# EAGLE schematic controll (EAGLE 5.06)
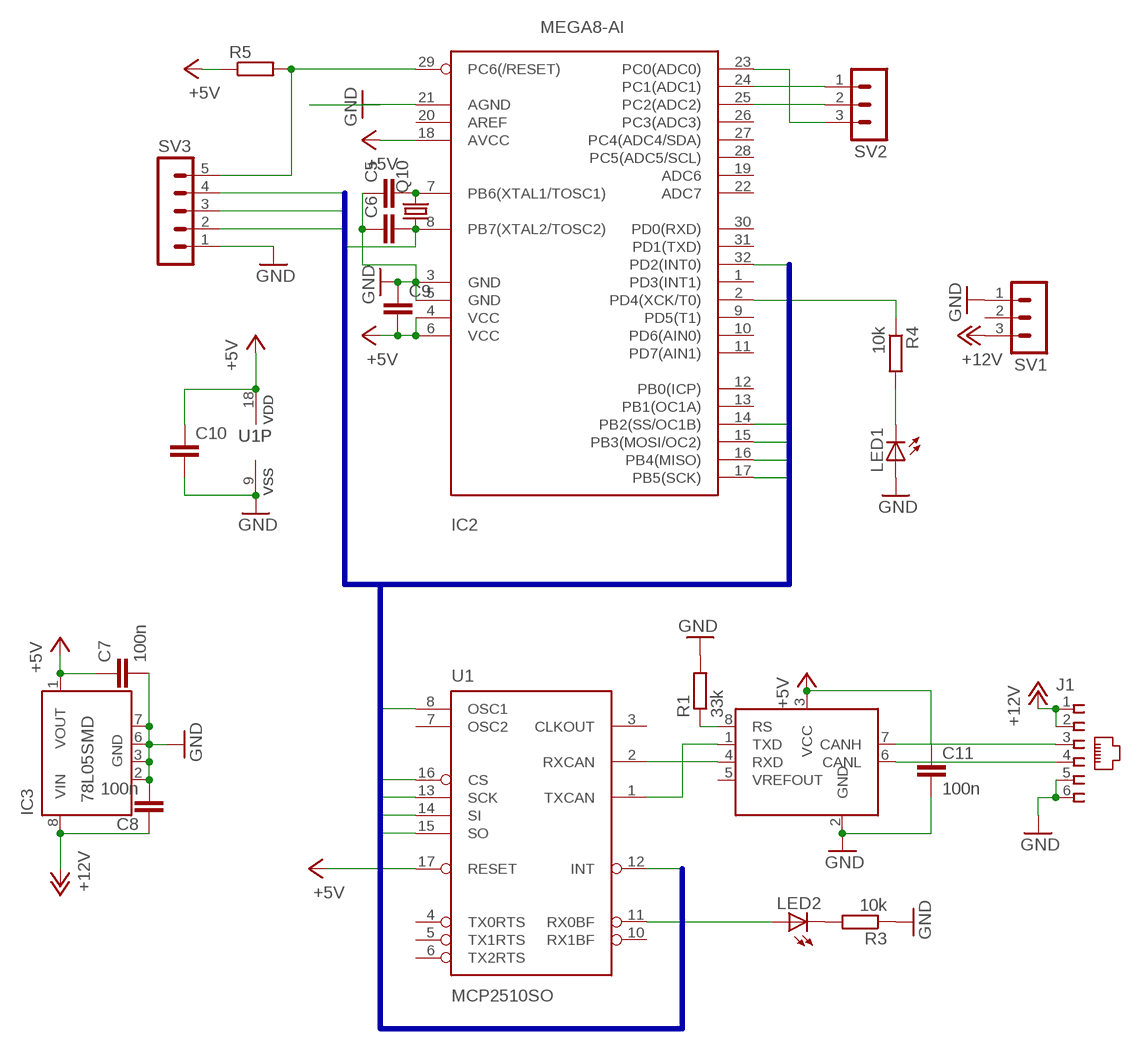
[diagram p0: schematic, sheet 1]

## Parts
C5  C-EUC1206  [C1206]
C6  C-EUC0805  [C0805]
C7  100n  C-EUC0805  [C0805]
C8  100n  C-EUC0805  [C0805]
C9  C-EUC0805  [C0805]
C10  C-EUC0805  [C0805]
C11  100n  C-EUC0805  [C0805]
IC1  82C250SMDSMD  [SO8]
IC2  MEGA8-AI  [TQFP32-08]
IC3  78L05SMD  [SO08]
J1  555165-1  [555165-1]
LED1  LEDCHIPLED_0603  [CHIPLED_0603]
LED2  LEDCHIPLED_0603  [CHIPLED_0603]
Q10  CRYTALHC49S  [HC49/S]
R1  33k  R-EU_R0805  [R0805]
R3  10k  R-EU_R0805  [R0805]
R4  10k  R-EU_R0805  [R0805]
R5  R-EU_R1206  [R1206]
SV1  MA03-1  [MA03-1]
SV2  MA03-1  [MA03-1]
SV3  MA05-1  [MA05-1]
U1  MCP2510SO  [SO-18W]

## Nets
+5V: C7.1 C9.2 C10.1 C11.1 IC1.3(VCC) IC2.4(VCC) IC2.6(VCC) IC2.18(AVCC) IC3.1(VOUT) R5.1 U1.17(RESET) U1.18(VDD)
+12V: C8.1 IC3.8(VIN) J1.1 J1.2 SV1.3
CLK: C6.2 IC2.8(PB7(XTAL2/TOSC2)) Q10.1 U1.8(OSC1)
GND: C5.1 C6.1 C7.2 C8.2 C9.1 C10.2 C11.2 IC1.2(GND) IC2.3(GND) IC2.5(GND) IC2.21(AGND) IC3.2(GND) IC3.3(GND) IC3.6(GND) IC3.7(GND) J1.5 J1.6 LED1.A R1.2 R3.1 SV1.1 SV3.1 U1.9(VSS)
INT: IC2.32(PD2(INT0)) U1.12(INT)
MISO: IC2.16(PB4(MISO)) SV3.2 U1.15(SO)
MOSI: IC2.15(PB3(MOSI/OC2)) SV3.3 U1.14(SI)
N$1: IC2.24(PC1(ADC1)) SV2.1
N$2: IC2.23(PC0(ADC0)) SV2.3
N$3: IC2.25(PC2(ADC2)) SV2.2
N$4: IC2.29(PC6(/RESET)) R5.2 SV3.5
N$15: C5.2 IC2.7(PB6(XTAL1/TOSC1)) Q10.2
N$30: LED1.C R4.2
N$34: IC1.7(CANH) J1.3
N$35: IC1.1(TXD) U1.1(TXCAN)
N$36: IC1.4(RXD) U1.2(RXCAN)
N$37: IC1.8(RS) R1.1
N$38: IC1.6(CANL) J1.4
N$39: LED2.A U1.11(RX0BF)
N$40: LED2.C R3.2
N$41: IC2.2(PD4(XCK/T0)) R4.1
SCK: IC2.17(PB5(SCK)) SV3.4 U1.13(SCK)
SS: IC2.14(PB2(SS/OC1B)) U1.16(CS)
Unconnected: IC1.5(VREFOUT) IC2.1(PD3(INT1)) IC2.9(PD5(T1)) IC2.10(PD6(AIN0)) IC2.11(PD7(AIN1)) IC2.12(PB0(ICP)) IC2.13(PB1(OC1A)) IC2.19(ADC6) IC2.20(AREF) IC2.22(ADC7) IC2.26(PC3(ADC3)) IC2.27(PC4(ADC4/SDA)) IC2.28(PC5(ADC5/SCL)) IC2.30(PD0(RXD)) IC2.31(PD1(TXD)) IC3.4(NC) IC3.5(NC) SV1.2 U1.3(CLKOUT) U1.4(TX0RTS) U1.5(TX1RTS) U1.6(TX2RTS) U1.7(OSC2) U1.10(RX1BF)

## Buses
SPI:SS,MOSI,MISO,SCK,INT,CLK

## Library data of the parts
C5-C11 = rcl:C-EU: CAPACITOR, European symbol
IC1 = philips:82C250SMD
IC2 = atmel:MEGA8: MICROCONTROLLER 8 Kbytes FLASH 1 kbytes SRAM 512 bytes EEPROM USART 6-channel 10 bit ADC 2-channel 8 bit ADC Source: avr.lbr
IC3 = linear:78L*SMD: Positive VOLTAGE REGULATOR
J1 = con-amp:555165-1: AMP connector
LED1 LED2 = led:LED: LED OSRAM: - CHIPLED LG R971, LG N971, LY N971, LG Q971, LY Q971, LO R971, LY R971 LH N974, LH R974 LS Q976, LO Q976, LY Q976 LO Q996 - Hyper CHIPLED LW Q18S LB Q993, LB Q99A, LB R99A - SideLED LS A670, LO A670, LY A670, LG A670, LP A670 LB A673, LV A673, LT A673, LW A673 LH A674 LY A675 LS A676, LA A676, LO A676, LY A676, LW A676 LS A679, LY A679, LG A679 - Hyper Micro SIDELED® LS Y876, LA Y876, LO Y876, LY Y876 LT Y87S - SmartLED LW L88C, LW L88S LB L89C, LB L89S, LG L890 LS L89K, LO L89K, LY L89K LS L896, LA L896, LO L896, LY L896 - TOPLED LS T670, LO T670, LY T670, LG T670, LP T670 LSG T670, LSP T670, LSY T670, LOP T670, LYG T670 LG T671, LOG T671, LSG T671 LB T673, LV T673, LT T673, LW T673 LH T674 LS T676, LA T676, LO T676, LY T676, LB T676, LH T676, LSB T676, LW T676 LB T67C, LV T67C, LT T67C, LS T67K, LO T67K, LY T67K, LW E67C LS E67B, LA E67B, LO E67B, LY E67B, LB E67C, LV E67C, LT E67C LW T67C LS T679, LY T679, LG T679 LS T770, LO T770, LY T770, LG T770, LP T770 LB T773, LV T773, LT T773, LW T773 LH T774 LS E675, LA E675, LY E675, LS T675 LS T776, LA T776, LO T776, LY T776, LB T776 LHGB T686 LT T68C, LB T68C - Hyper Mini TOPLED® LB M676 - Mini TOPLED Santana® LG M470 LS M47K, LO M47K, LY M47K Source: http://www.osram.convergy.de - LUMILED® LXK2-PW12-R00, LXK2-PW12-S00, LXK2-PW14-U00, LXK2-PW14-V00 LXK2-PM12-R00, LXK2-PM12-S00, LXK2-PM14-U00 LXK2-PE12-Q00, LXK2-PE12-R00, LXK2-PE12-S00, LXK2-PE14-T00, LXK2-PE14-U00 LXK2-PB12-K00, LXK2-PB12-L00, LXK2-PB12-M00, LXK2-PB14-N00, LXK2-PB14-P00, LXK2-PB14-Q00 LXK2-PR12-L00, LXK2-PR12-M00, LXK2-PR14-Q00, LXK2-PR14-R00 LXK2-PD12-Q00, LXK2-PD12-R00, LXK2-PD12-S00 LXK2-PH12-R00, LXK2-PH12-S00 LXK2-PL12-P00, LXK2-PL12-Q00, LXK2-PL12-R00 Source: www.luxeon.com
Q10 = crystal:CRYTAL: CRYSTAL
R1 R3-R5 = rcl:R-EU_: RESISTOR, European symbol
SV1 SV2 = con-lstb:MA03-1: PIN HEADER
SV3 = con-lstb:MA05-1: PIN HEADER
U1 = microchip_can:MCP2510